# EAGLE design BT AQ DOL R3 (EAGLE 9.6.2)
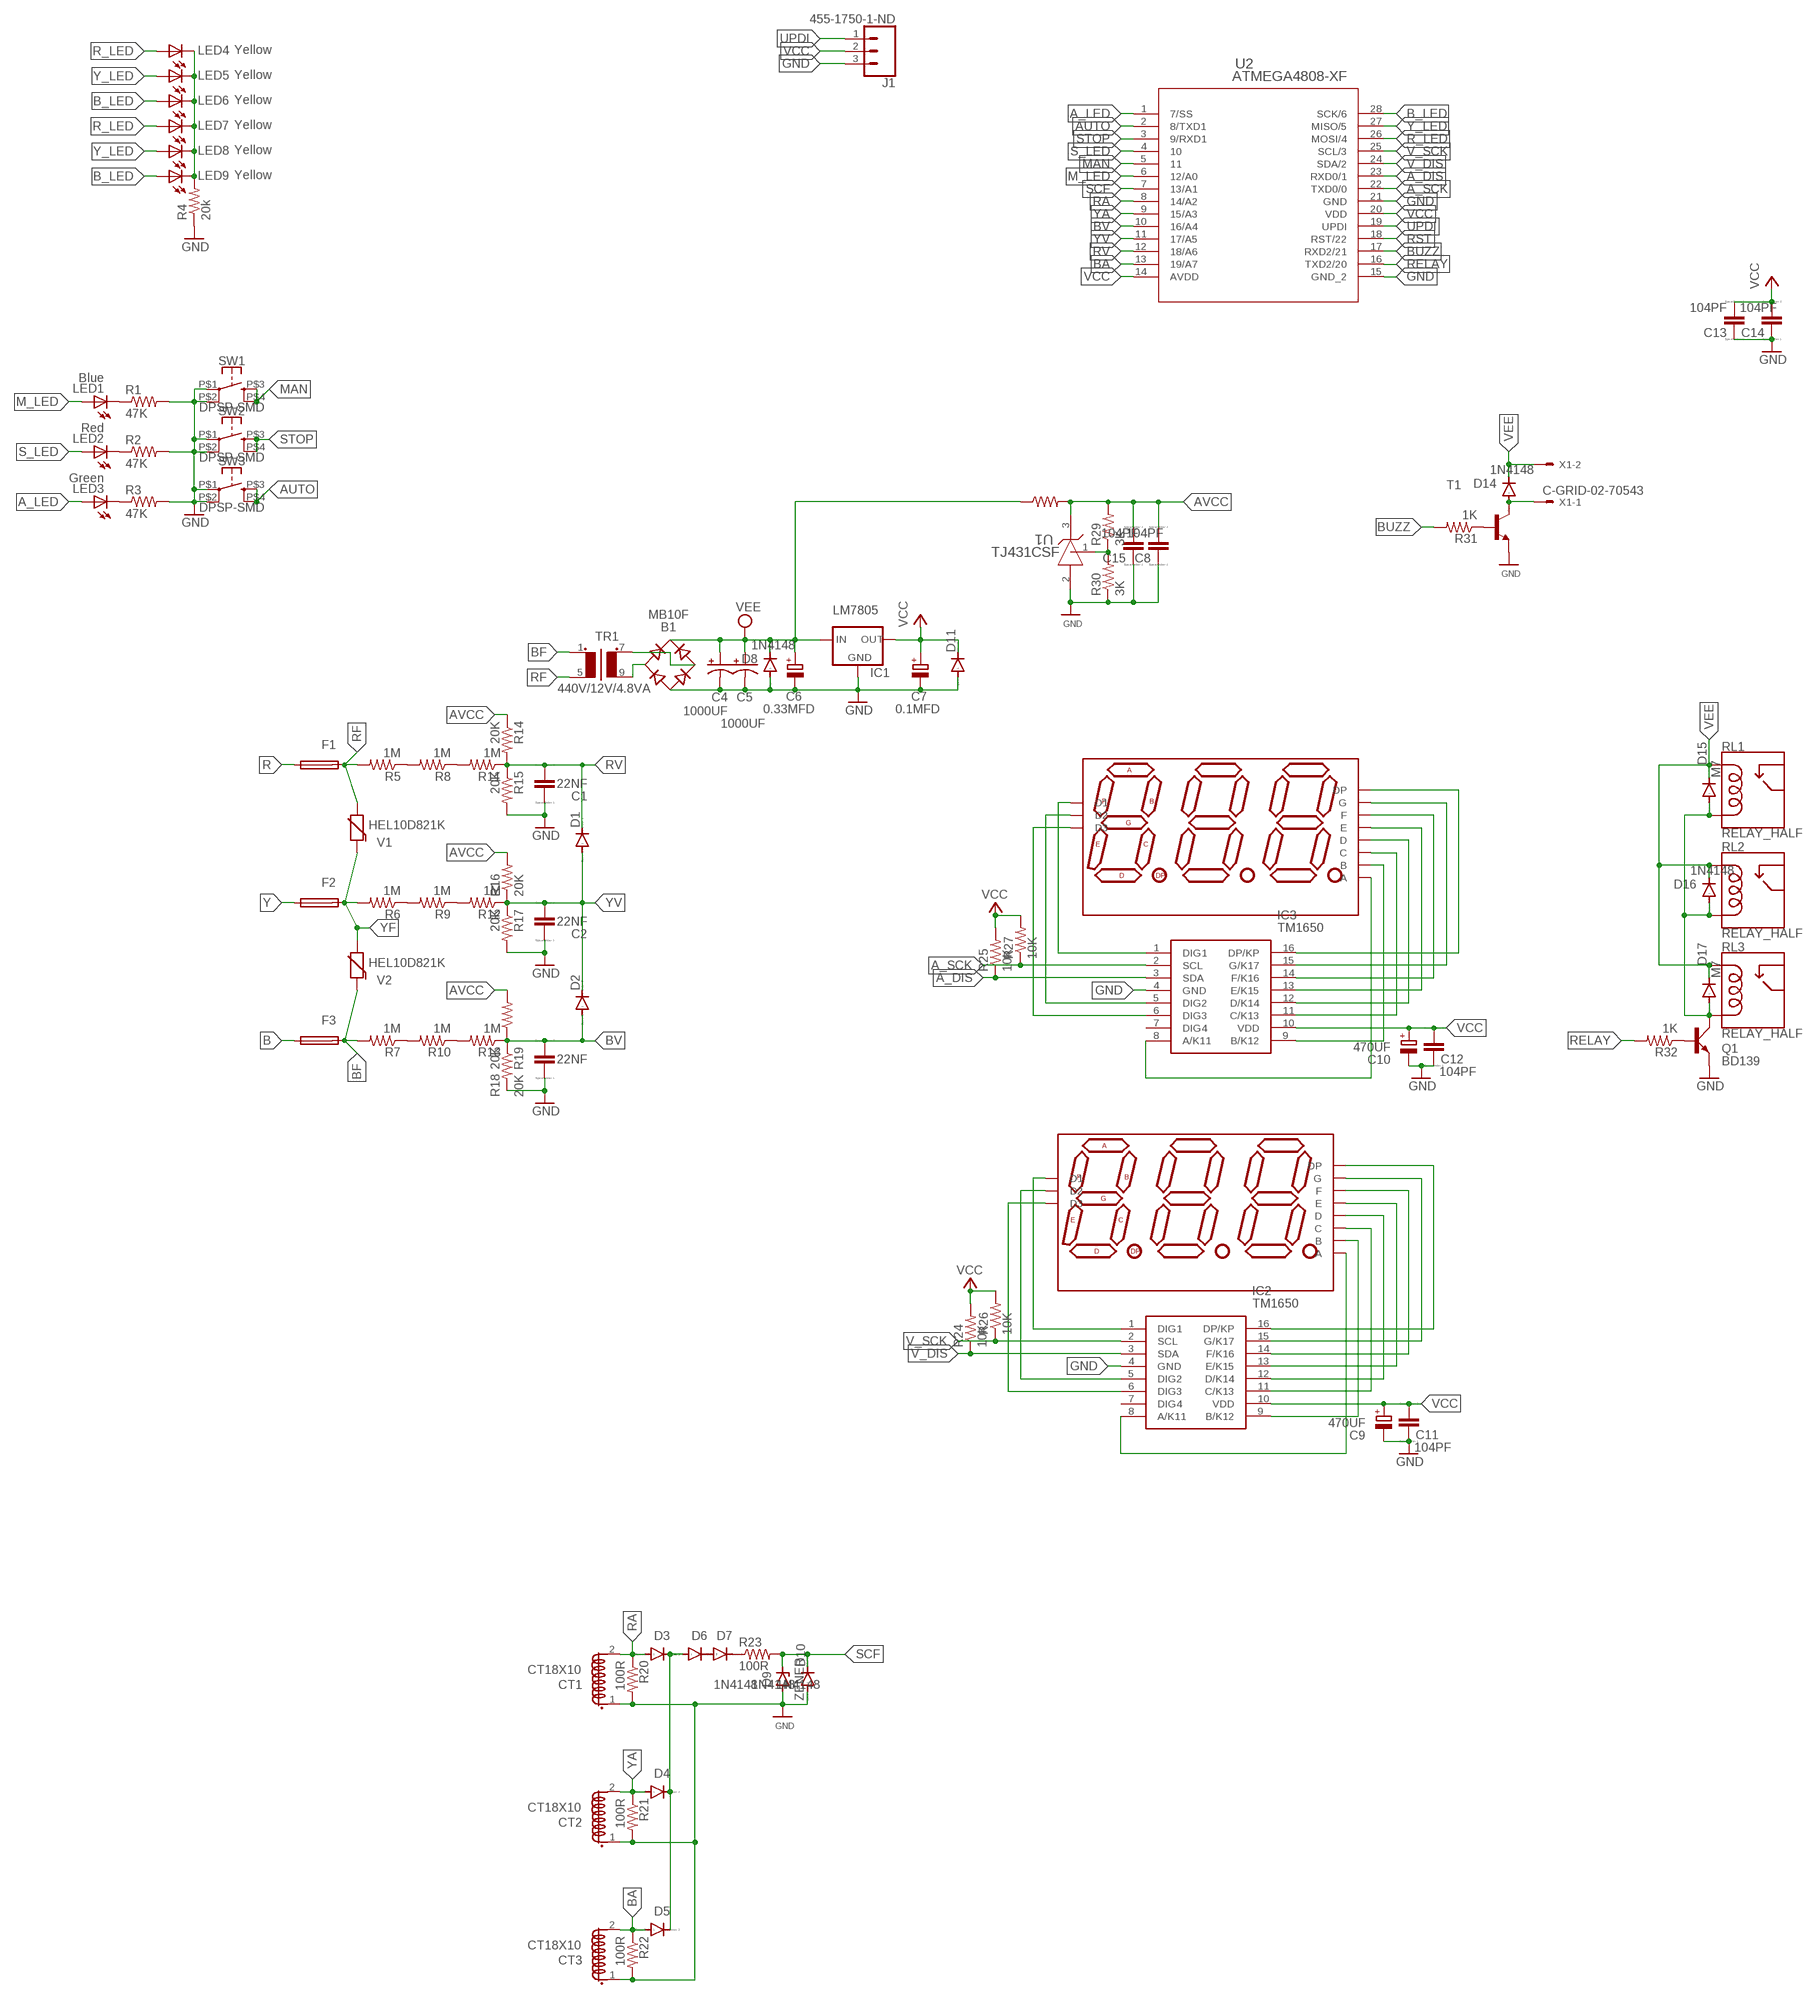
[diagram p0: schematic, sheet 1]

## Parts
B1  MB10F  MB8S  [SOIC-4]
C1  22NF  CC1206  [C1206]
C2  22NF  CC1206  [C1206]
C3  22NF  CC1206  [C1206]
C4  1000UF  CPOL-USE3.5-10  [E3,5-10]
C5  1000UF  CPOL-USE3.5-10  [E3,5-10]
C6  0.33MFD  CPOL-EUE2.5-5  [E2,5-5]
C7  0.1MFD  CPOL-EUE2.5-5  [E2,5-5]
C8  104PF  CC1206  [C1206]
C9  470UF  CPOL-EUE3.5-8  [E3,5-8]
C10  470UF  CPOL-EUE3.5-8  [E3,5-8]
C11  104PF  CC1206  [C1206]
C12  104PF  CC1206  [C1206]
C13  104PF  CC1206  [C1206]
C14  104PF  CC1206  [C1206]
C15  104PF  CC1206  [C1206]
CT1  CT18X10  [ZMCT103C]
CT2  CT18X10  [ZMCT103C]
CT3  CT18X10  [ZMCT103C]
D1  DIODE-DO214AA  [DO214AA]
D2  DIODE-DO214AA  [DO214AA]
D3  1N4148  DIODE-MINIMELF  [MINIMELF]
D4  1N4148  DIODE-MINIMELF  [MINIMELF]
D5  1N4148  DIODE-MINIMELF  [MINIMELF]
D6  1N4148  DIODE-MINIMELF  [MINIMELF]
D7  1N4148  DIODE-MINIMELF  [MINIMELF]
D8  1N4148  DIODE-MINIMELF  [MINIMELF]
D9  ZENER  ZENER__DO-213AA(SOD-80)  [DIOMELF3516]
D10  DIODE-DO214AA  [DO214AA]
D11  DIODE-DO214AA  [DO214AA]
D12  SUNR036CC3D  7SEGMENT-3DIGITDIP  [7S3D036_DIP]
D13  SUNR036CC3D  7SEGMENT-3DIGITDIP  [7S3D036_DIP]
D14  1N4148  DIODE-MINIMELF  [MINIMELF]
D15  M7  DIODE-DO-214AC  [DO-214AC]
D16  1N4148  DIODE-MINIMELF  [MINIMELF]
D17  M7  DIODE-DO-214AC  [DO-214AC]
F1  TRF600-150  PPTCPTH  [TRF600-150]
F2  TRF600-150  PPTCPTH  [TRF600-150]
F3  TRF600-150  PPTCPTH  [TRF600-150]
IC1  LM7805  78XXS  [78XXS]
IC2  TM1650  [SOIC127P604X185-16N]
IC3  TM1650  [SOIC127P604X185-16N]
J1  455-1750-1-ND  CONN_03  [1X03]
LED1  Blue  LED3MM  [LED3MM]
LED2  Red  LED3MM  [LED3MM]
LED3  Green  LED3MM  [LED3MM]
LED4  Yellow  LED3MM  [LED3MM]
LED5  Yellow  LED3MM  [LED3MM]
LED6  Yellow  LED3MM  [LED3MM]
LED7  Yellow  LED3MM  [LED3MM]
LED8  Yellow  LED3MM  [LED3MM]
LED9  Yellow  LED3MM  [LED3MM]
Q1  BD139  [TO126AV]
R1  47K  R-US_M1206  [M1206]
R2  47K  R-US_M1206  [M1206]
R3  47K  R-US_M1206  [M1206]
R4  20k  R-US_M1206  [M1206]
R5  1M  R-US_M1206  [M1206]
R6  1M  R-US_M1206  [M1206]
R7  1M  R-US_M1206  [M1206]
R8  1M  R-US_M1206  [M1206]
R9  1M  R-US_M1206  [M1206]
R10  1M  R-US_M1206  [M1206]
R11  1M  R-US_M1206  [M1206]
R12  1M  R-US_M1206  [M1206]
R13  1M  R-US_M1206  [M1206]
R14  20K  R-US_M1206  [M1206]
R15  20K  R-US_M1206  [M1206]
R16  20K  R-US_M1206  [M1206]
R17  20K  R-US_M1206  [M1206]
R18  20K  R-US_M1206  [M1206]
R19  20K  R-US_M1206  [M1206]
R20  100R  R-US_M1206  [M1206]
R21  100R  R-US_M1206  [M1206]
R22  100R  R-US_M1206  [M1206]
R23  100R  R-US_M1206  [M1206]
R24  10K  R-US_M1206  [M1206]
R25  10K  R-US_M1206  [M1206]
R26  10K  R-US_M1206  [M1206]
R27  10K  R-US_M1206  [M1206]
R28  10K  R-US_M1206  [M1206]
R29  3K  R-US_M1206  [M1206]
R30  3K  R-US_M1206  [M1206]
R31  1K  R-US_M1206  [M1206]
R32  1K  R-US_M1206  [M1206]
RL1  RELAY_HALF  [DT90_HALF]
RL2  RELAY_HALF  [DT90_HALF]
RL3  RELAY_HALF  [DT90_HALF]
SW1  DPSP-SMD  [B3F-40XX-ROUND-SMD]
SW2  DPSP-SMD  [B3F-40XX-ROUND-SMD]
SW3  DPSP-SMD  [B3F-40XX-ROUND-SMD]
T1  MMUN2213LT1-NPN-SC59-BEC  [SC59-BEC]
TR1  440V/12V/4.8VA  TRANSFORMER6VA  [440V12V6VA]
U1  TJ431CSF  TJ431CSFDBZ0003A_L  [SOT-23]
U2  ATMEGA4808-XF  [SSOP28_SS_MCH]
V1  HEL10D821K  VARISTOR  [10MM]
V2  HEL10D821K  VARISTOR  [10MM]
X1  C-GRID-02-70543  [70543-02]

## Nets
A_DIS: IC3.3(SDA) R25.1 U2.23(RXD0/1)
A_LED: LED3.A U2.1(7/SS)
A_SCK: IC3.2(SCL) R27.1 U2.22(TXD0/0)
AUTO: SW3.P$3 SW3.P$4 U2.2(8/TXD1)
AVCC: C8.2 C15.2 R14.1 R16.2 R18.2 R28.2 R29.2 U1.3(CATHODE)
B: F3.1
B_LED: LED6.A LED9.A U2.28(SCK/6)
BA: CT3.2(S1.2) D5.A R22.1 U2.13(19/A7)
BF: F3.2 R7.2 TR1.1 V2.1
BUZZ: R31.2 U2.17(RXD2/21)
BV: C3.2 D2.A R13.1 R18.1 R19.1 U2.10(16/A4)
GND: B1.- C1.1 C2.1 C3.1 C4.- C5.- C6.- C7.- C8.1 C9.- C10.- C11.1 C12.1 C13.1 C14.1 C15.1 CT1.1(S1.1) CT2.1(S1.1) CT3.1(S1.1) D8.A D9.2(A) D10.A D11.A IC1.GND IC2.4(GND) IC3.4(GND) J1.3 Q1.E R1.2 R2.2 R3.2 R4.1 R15.2 R17.2 R19.2 R20.2 R21.2 R22.2 R30.1 SW1.P$1 SW1.P$2 SW2.P$1 SW2.P$2 SW3.P$1 SW3.P$2 T1.E U1.2(ANODE) U2.15(GND_2) U2.21(GND)
M_LED: LED1.A U2.6(12/A0)
MAN: SW1.P$3 SW1.P$4 U2.5
N$1: B1.~2(AC2) TR1.7(S1)
N$2: B1.~1(AC1) TR1.9(S2)
N$3: D14.A T1.C X1.1
N$4: R31.1 T1.B
N$5: LED3.K(C) R3.1
N$6: LED2.K(C) R2.1
N$8: LED1.K(C) R1.1
N$9: R29.1 R30.2 U1.1(REF)
N$10: LED4.K(C) LED5.K(C) LED6.K(C) LED7.K(C) LED8.K(C) LED9.K(C) R4.2
N$11: D7.C R23.1
N$12: D6.C D7.A
N$13: R5.1 R8.2
N$14: R8.1 R11.2
N$15: R6.1 R9.2
N$18: R7.1 R10.2
N$19: R9.1 R12.2
N$22: Q1.B R32.1
N$23: R10.1 R13.2
N$28: D13.11(A) IC3.8(A/K11)
N$29: D13.7(B) IC3.9(B/K12)
N$30: D13.4(C) IC3.11(C/K13)
N$31: D13.2(D) IC3.12(D/K14)
N$32: D13.1(E) IC3.13(E/K15)
N$33: D13.10(F) IC3.14(F/K16)
N$34: D13.5(G) IC3.15(G/K17)
N$35: D13.3(DP) IC3.16(DP/KP)
N$36: D13.12(D1) IC3.1(DIG1)
N$37: D13.9(D2) IC3.5(DIG2)
N$38: D13.8(D3) IC3.6(DIG3)
N$39: D12.11(A) IC2.8(A/K11)
N$40: D12.7(B) IC2.9(B/K12)
N$41: D12.4(C) IC2.11(C/K13)
N$42: D3.C D4.C D5.C D6.A
N$44: D12.2(D) IC2.12(D/K14)
N$48: D12.1(E) IC2.13(E/K15)
N$49: D12.10(F) IC2.14(F/K16)
N$50: D12.5(G) IC2.15(G/K17)
N$51: D12.3(DP) IC2.16(DP/KP)
N$52: D12.12(D1) IC2.1(DIG1)
N$53: D12.9(D2) IC2.5(DIG2)
N$54: D12.8(D3) IC2.6(DIG3)
N$121: D15.A D16.A D17.A Q1.C RL1.2(COIL2) RL2.2(COIL2) RL3.2(COIL2)
R: F1.1
R_LED: LED4.A LED7.A U2.26(MOSI/4)
RA: CT1.2(S1.2) D3.A R20.1 U2.8(14/A2)
RELAY: R32.2 U2.16(TXD2/20)
RF: F1.2 R5.2 TR1.5(P2) V1.2
RST: U2.18(RST/22)
RV: C1.2 D1.C R11.1 R14.2 R15.1 U2.12(18/A6)
S_LED: LED2.A U2.4
SCF: D9.1(C) D10.C R23.2 U2.7(13/A1)
STOP: SW2.P$3 SW2.P$4 U2.3(9/RXD1)
UPDI: J1.1 U2.19(UPDI)
V_DIS: IC2.3(SDA) R24.1 U2.24(SDA/2)
V_SCK: IC2.2(SCL) R26.1 U2.25(SCL/3)
VCC: C7.+ C9.+ C10.+ C11.2 C12.2 C13.2 C14.2 D11.C IC1.OUT IC2.10(VDD) IC3.10(VDD) J1.2 R24.2 R25.2 R26.2 R27.2 U2.14(AVDD) U2.20(VDD)
VEE [VEE]: B1.+ C4.+ C5.+ C6.+ D8.C D14.C D15.C D16.C D17.C IC1.IN R28.1 RL1.1(COIL1) RL2.1(COIL1) RL3.1(COIL1) X1.2
Y: F2.1
Y_LED: LED5.A LED8.A U2.27(MISO/5)
YA: CT2.2(S1.2) D4.A R21.1 U2.9(15/A3)
YF: F2.2 R6.2 V1.1 V2.2
YV: C2.2 D1.A D2.C R12.1 R16.1 R17.1 U2.11(17/A5)
Unconnected: IC2.7(DIG4) IC3.7(DIG4)

## Library data of the parts
B1 = rectifier:MB*S: Bridge Rectifier Source: http://www.fairchildsemi.com/ds/MB/MB6S.pdf
C1-C3 C8 C11-C15 = eagle-ltspice:C: CAPACITOR, European symbol; SPICEMODEL: NONE; SPICEPREFIX: C
C4 C5 = rcl:CPOL-US: POLARIZED CAPACITOR, American symbol; SPICEPREFIX: C
C6 C7 C9 C10 = rcl:CPOL-EU: POLARIZED CAPACITOR, European symbol; SPICEPREFIX: C
CT1-CT3 = User Components:CT
D1-D8 D10 D11 D14-D17 = diode:DIODE-: DIODE
D9 = Tinkercad:ZENER: Zener Diode - Generic; CATEGORY: Diode; SUB-CATEGORY: Zener
D12 D13 = User Components:7SEGMENT-3DIGIT
F1-F3 = User Components:PPTC: FUSE Wickmann; OC_FARNELL: unknown; OC_NEWARK: unknown
IC1 = v-reg:78XXS: VOLTAGE REGULATOR
IC2 IC3 = User Components:TM1650: The TM1650 is a dedicated LED (LED display) drive control circuit with a keyboard scan interface. The MCU input and output control digital interface, data latch, LED driver, keyboard scan, brightness adjustment and other circuits are integrated inside. The TM1650's stable performance, reliable quality, and high immunity to interference make it suitable for long-term continuous operation in 24 hours Source: Datasheet <http://www.titanmec.com/index.php/en/product/download/id/540.html>; DESCRIPTION: The TM1650 is a dedicated LED (LED display) drive control circuit with a keyboard scan interface. The MCU input and output control digital interface, data latch, LED driver, keyboard scan, brightness adjustment and other circuits are integrated inside. The TM1650's stable performance, reliable quality, and high immunity to interference make it suitable for long-term continuous operation in 24 hours; HEIGHT: 1.85mm; MANUFACTURER_NAME: TITAN MICRO ELECTRONICS; MANUFACTURER_PART_NUMBER: tm1650
J1 = SparkFun-Connectors:CONN_03: Multi connection point. Often used as Generic Header-pin footprint for 0.1 inch spaced/style header connections On any of the 0.1 inch spaced packages, you can populate with these: Break Away Headers - Straight <https://www.sparkfun.com/products/116> (PRT-00116) Break Away Male Headers - Right Angle <https://www.sparkfun.com/products/553> (PRT-00553) Female Headers <https://www.sparkfun.com/products/115> (PRT-00115) Break Away Headers - Machine Pin <https://www.sparkfun.com/products/117> (PRT-00117) Break Away Female Headers - Swiss Machine Pin <https://www.sparkfun.com/products/743> (PRT-00743) Stackable Header - 3 Pin (Female, 0.1") <https://www.sparkfun.com/products/13875> (PRT-13875) For SCREWTERMINALS and SPRING TERMINALS visit here: Screw Terimnals on SparkFun.com <https://www.sparkfun.com/search/results?term=Screw+Terminals> (5mm/3.5mm/2.54mm spacing) This device is also useful as a general connection point to wire up your design to another part of your project. Our various solder wires solder well into these plated through hole pads. Hook-Up Wire - Assortment (Stranded, 22 AWG) <https://www.sparkfun.com/products/11375> (PRT-11375) Hook-Up Wire - Assortment (Solid Core, 22 AWG) <https://www.sparkfun.com/products/11367> (PRT-11367) View the entire wire category on our website here <https://www.sparkfun.com/categories/141> Special notes: Molex polarized connector foot print use with SKU : PRT-08232 with associated crimp pins and housings.; PROD_ID: XXX-00000
LED1-LED9 = adafruit:LED: LED OSRAM: - CHIPLED LG R971, LG N971, LY N971, LG Q971, LY Q971, LO R971, LY R971 LH N974, LH R974 LS Q976, LO Q976, LY Q976 LO Q996 - Hyper CHIPLED LW Q18S LB Q993, LB Q99A, LB R99A - SideLED LS A670, LO A670, LY A670, LG A670, LP A670 LB A673, LV A673, LT A673, LW A673 LH A674 LY A675 LS A676, LA A676, LO A676, LY A676, LW A676 LS A679, LY A679, LG A679 - Hyper Micro SIDELED® LS Y876, LA Y876, LO Y876, LY Y876 LT Y87S - SmartLED LW L88C, LW L88S LB L89C, LB L89S, LG L890 LS L89K, LO L89K, LY L89K LS L896, LA L896, LO L896, LY L896 - TOPLED LS T670, LO T670, LY T670, LG T670, LP T670 LSG T670, LSP T670, LSY T670, LOP T670, LYG T670 LG T671, LOG T671, LSG T671 LB T673, LV T673, LT T673, LW T673 LH T674 LS T676, LA T676, LO T676, LY T676, LB T676, LH T676, LSB T676, LW T676 LB T67C, LV T67C, LT T67C, LS T67K, LO T67K, LY T67K, LW E67C LS E67B, LA E67B, LO E67B, LY E67B, LB E67C, LV E67C, LT E67C LW T67C LS T679, LY T679, LG T679 LS T770, LO T770, LY T770, LG T770, LP T770 LB T773, LV T773, LT T773, LW T773 LH T774 LS E675, LA E675, LY E675, LS T675 LS T776, LA T776, LO T776, LY T776, LB T776 LHGB T686 LT T68C, LB T68C - Hyper Mini TOPLED® LB M676 - Mini TOPLED Santana® LG M470 LS M47K, LO M47K, LY M47K Source: http://www.osram.convergy.de/
Q1 = transistor-power:BD139: NPN TRANSISTOR
R1-R19 R24-R27 R31 R32 = rcl:R-US_: RESISTOR, American symbol; SPICEPREFIX: R
R20-R23 R28-R30 = rcl:R-US_: RESISTOR, American symbol
RL1-RL3 = User Components:RELAY_HALF
SW1-SW3 = User Components:DPSP-SMD
T1 = transistor:*-NPN-: NPN Transistror BF959 corrected 2008.03.06
TR1 = User Components:TRANSFORMER
U1 = User Components:TJ431CSF; COPYRIGHT: Copyright (C) 2022 Ultra Librarian. All rights reserved.; MANUFACTURER_PART_NUMBER: TL431IDBZTG4; MFR_NAME: Texas Instruments; REFDES: RefDes; TYPE: TYPE
U2 = User Components:ATMEGA4808-XF; COPYRIGHT: Copyright (C) 2022 Ultra Librarian. All rights reserved.; MANUFACTURER_PART_NUMBER: ATMEGA4808-XF; MFR_NAME: Microchip
V1 V2 = User Components:VARISTOR
X1 = con-molex:C-GRID-02: CONNECTOR wire to board 2.54 mm (0.100") pitch header; MF: MOLEX; OC_FARNELL: unknown; OC_NEWARK: unknown

## Net classes
0 default: width 0.254 mm, drill 0.508 mm, clearance 0.381 mm
1 VEE: width 0.762 mm, drill 0.508 mm, clearance 0.508 mm

## Board
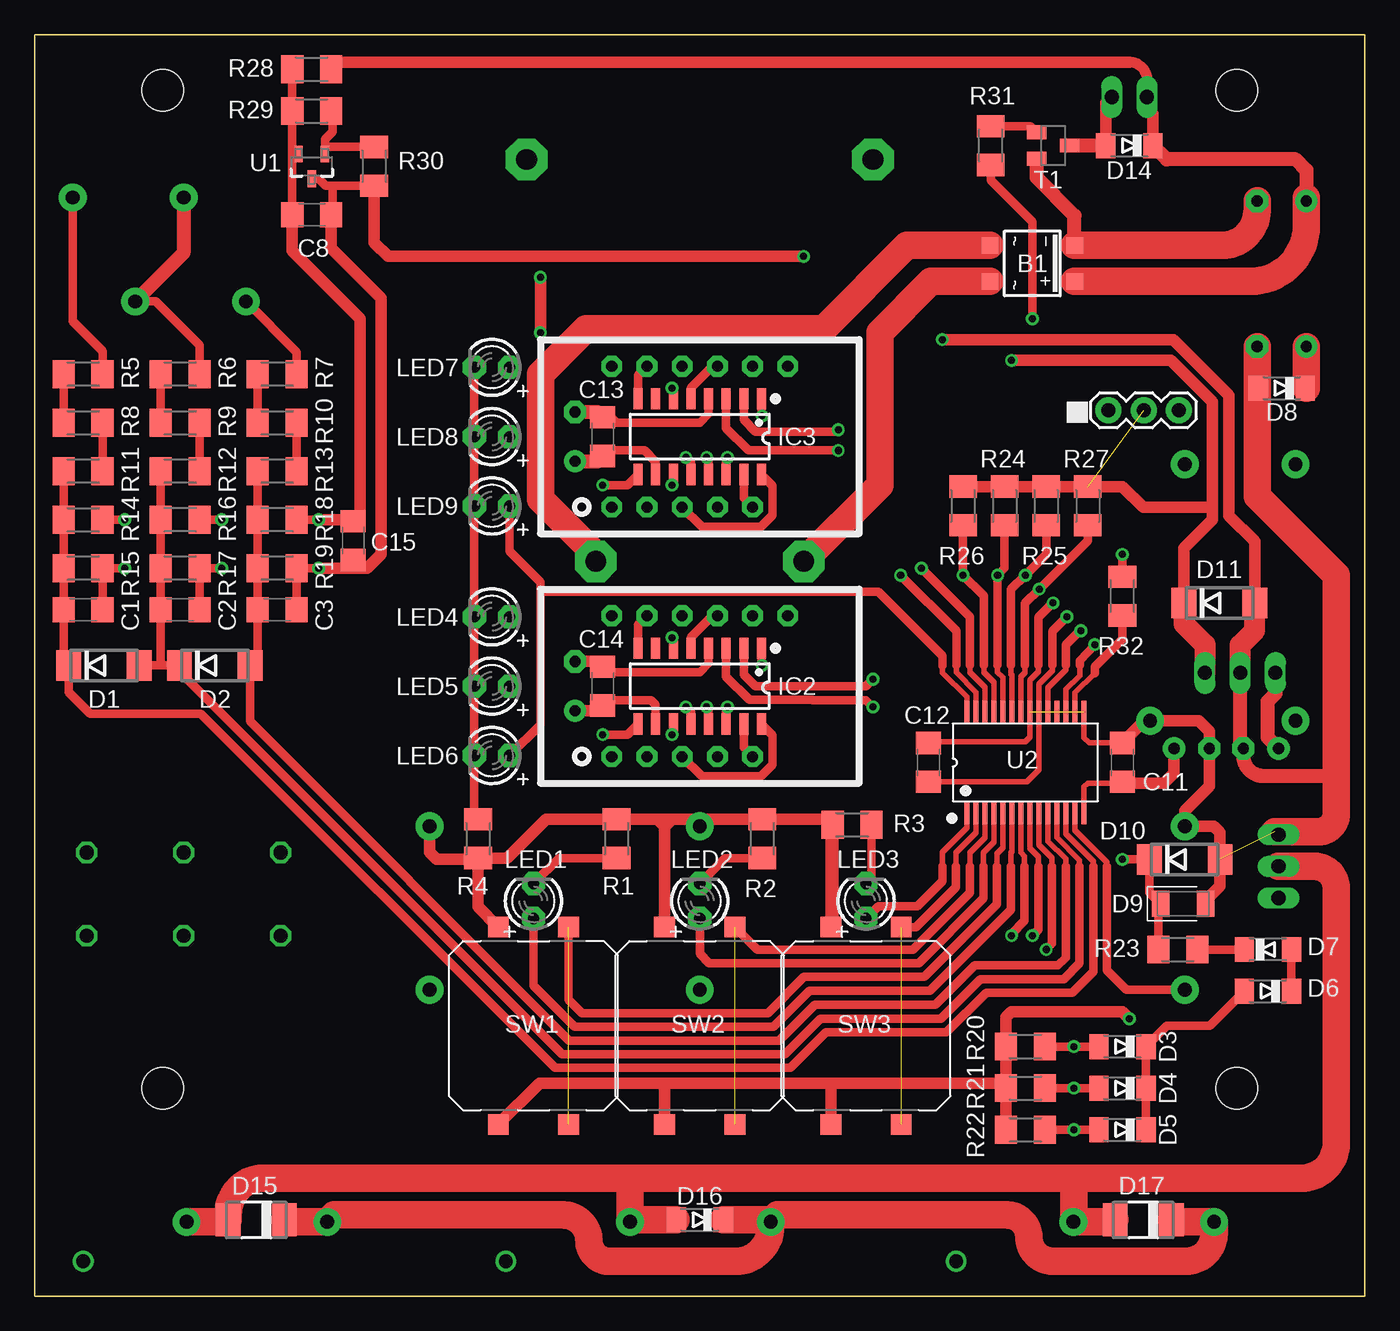
[diagram p1: board, top side]
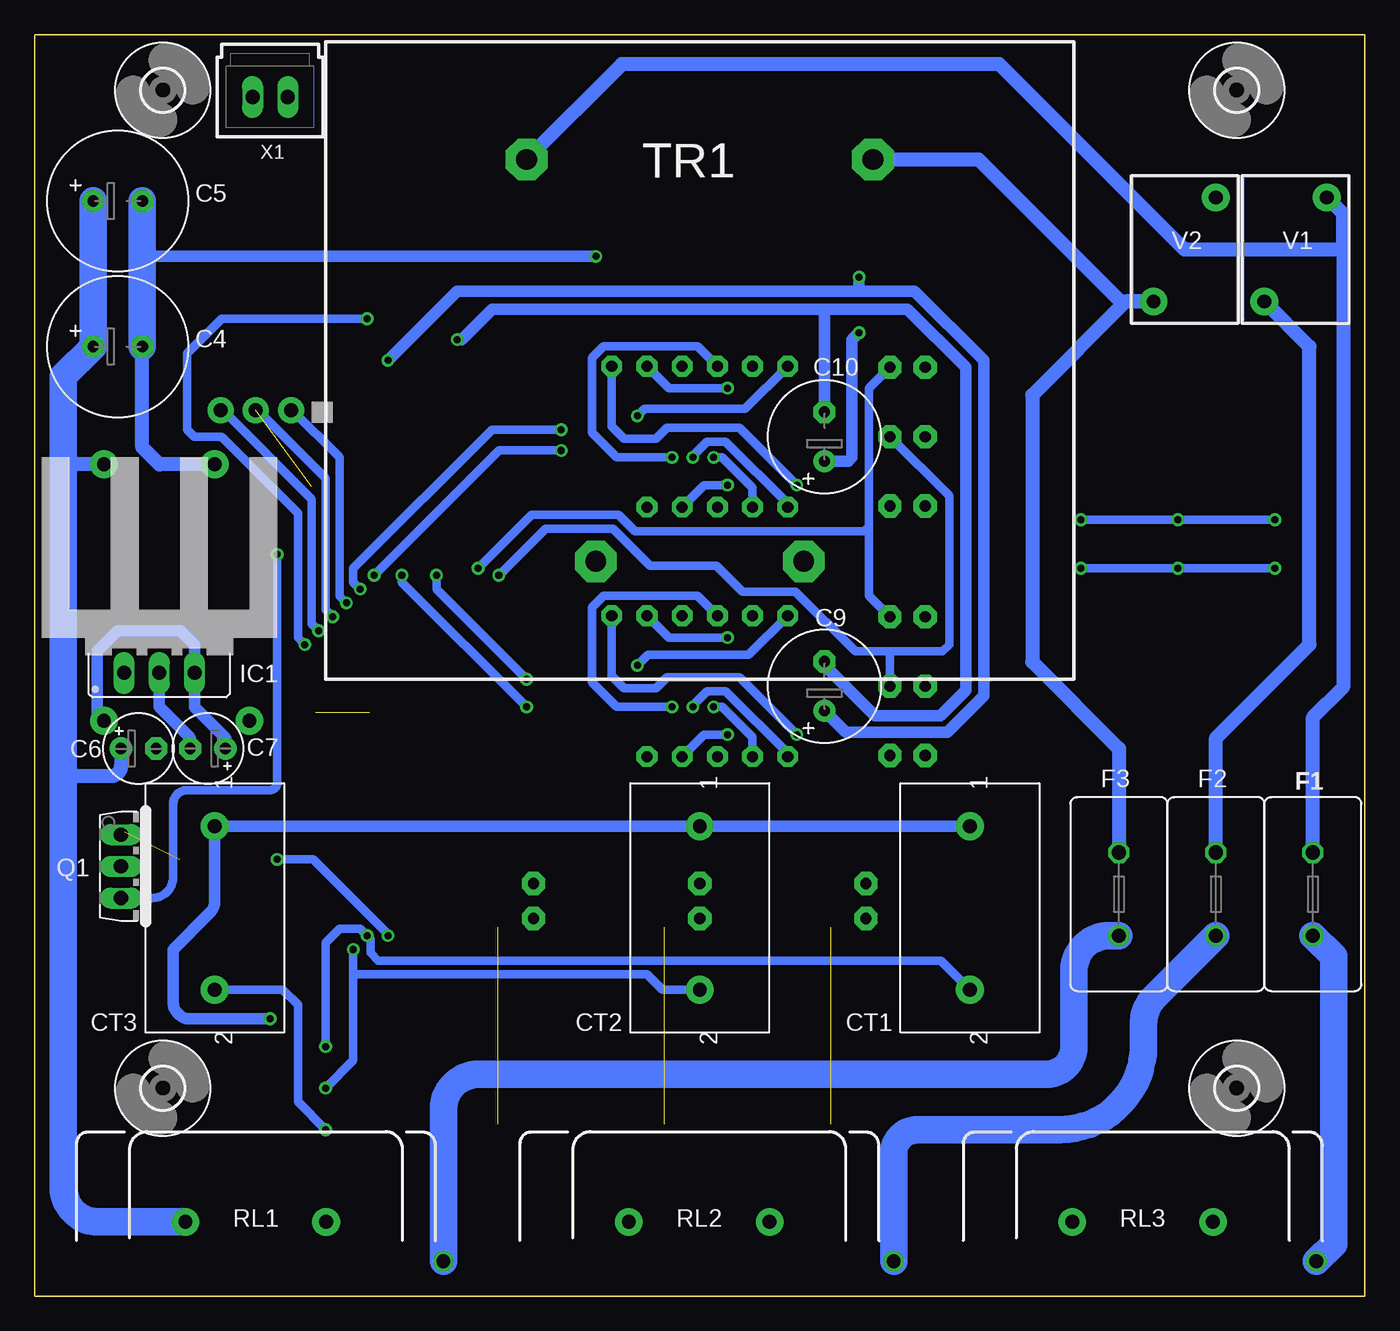
[diagram p2: board, bottom side, seen from below]

Size 96 x 91 mm. Coordinates in mm from the lower left corner, seen from the top.
Outline: 96,0 96,91 0,91 0,0 96,0
Copper layers (1*16): Top 0.035mm / dielectric 1.5mm / Bottom 0.035mm
Design rules "default *": minimum track width 6mil, minimum drill 0.35mm, track to track 6mil, track to pad 6mil, pad to pad 6mil, via to via 6mil, smd to smd 6mil, copper to edge 40mil, drill to drill 6mil, minimum pad ring 10mil, minimum via ring 8mil, stop-mask expansion 4mil, vias tented up to drill 20mil, thermal gap 10mil

### Footprints (pad centres in the part's own frame; a part is rotated, then mirrored left to right if it is on the bottom)
SOIC-4 = smd 1.2 x 1.2: + 1.3,3.05; - -1.3,3.05; ~1 -1.3,-3.05; ~2 1.3,-3.05
C1206 = smd 1.6 x 1.8: 1 -1.4,0; 2 1.4,0
E3,5-10 = drill 0.813 pad 1.6: + -1.778,0 | drill 0.813 pad 1.6 octagon: - 1.778,0
E2,5-5 = drill 0.813 pad 1.6: + -1.27,0 | drill 0.813 pad 1.6 octagon: - 1.27,0
E3,5-8 = drill 0.813 pad 1.6: + -1.778,0 | drill 0.813 pad 1.6 octagon: - 1.778,0
ZMCT103C = drill 1 pad 2: 1 -5.9,0; 2 5.9,0
DO214AA = smd 1.8 x 2.2: A 2.55,0; C -2.55,0
MINIMELF = smd 1.4 x 1.8: A 1.7,0; C -1.7,0
DIOMELF3516 = smd 1.275 x 1.85: 1 -1.62,0; 2 1.62,0
7S3D036_DIP = drill 0.8 pad 1.5 octagon: 1 -6.35,-5.08; 2 -3.81,-5.08; 3 -1.27,-5.08; 4 1.27,-5.08; 5 3.81,-5.08; 7 6.35,5.08; 8 3.81,5.08; 9 1.27,5.08; 10 -1.27,5.08; 11 -3.81,5.08; 12 -6.35,5.08
DO-214AC = smd 1.8 x 2.4: A 2.025,0; C -2.025,0
TRF600-150 = drill 1.016 octagon: 1 -3,0; 2 3,0
78XXS = drill 1.016 long: GND 0,-2.54; IN -2.54,-2.54; OUT 2.54,-2.54
SOIC127P604X185-16N = smd 1.53 x 0.65: 1 -2.735,4.445; 2 -2.735,3.175; 3 -2.735,1.905; 4 -2.735,0.635; 5 -2.735,-0.635; 6 -2.735,-1.905; 7 -2.735,-3.175; 8 -2.735,-4.445; 9 2.735,-4.445; 10 2.735,-3.175; 11 2.735,-1.905; 12 2.735,-0.635; 13 2.735,0.635; 14 2.735,1.905; 15 2.735,3.175; 16 2.735,4.445
1X03 = drill 1.016 pad 1.88: 1 0,0; 2 2.54,0; 3 5.08,0
LED3MM = drill 0.813 pad 1.676 octagon: A -1.27,0; K 1.27,0
TO126AV = drill 1.016 long: B 2.286,-1.27; C 0,-1.27; E -2.286,-1.27
M1206 = smd 1.6 x 2: 1 -1.4,0; 2 1.4,0
DT90_HALF = drill 1 pad 2: 1 -5.12,-0.15; 2 5.04,-0.15
B3F-40XX-ROUND-SMD = smd 1.5 x 1.5: P$1 -7.12,2.54; P$2 7.12,2.54; P$3 -7.12,-2.54; P$4 7.12,-2.54
SC59-BEC = smd 1 x 1.4: B -0.95,-1.2; C 0,1.2; E 0.95,-1.2
440V12V6VA = drill 1.5 pad 3 octagon: 1 -14.5,12.5; 5 -14.5,-12.5; 7 14.5,-7.5; 9 14.5,7.5
SOT-23 = smd 0.6 x 1.2: 1 -0.95,-0.9; 2 0,0.9; 3 0.95,-0.9
SSOP28_SS_MCH = smd 1.651 x 0.381: 1 -3.632,4.225; 2 -3.632,3.575; 3 -3.632,2.925; 4 -3.632,2.275; 5 -3.632,1.625; 6 -3.632,0.975; 7 -3.632,0.325; 8 -3.632,-0.325; 9 -3.632,-0.975; 10 -3.632,-1.625; 11 -3.632,-2.275; 12 -3.632,-2.925; 13 -3.632,-3.575; 14 -3.632,-4.225; 15 3.632,-4.225; 16 3.632,-3.575; 17 3.632,-2.925; 18 3.632,-2.275; 19 3.632,-1.625; 20 3.632,-0.975; 21 3.632,-0.325; 22 3.632,0.325; 23 3.632,0.975; 24 3.632,1.625; 25 3.632,2.275; 26 3.632,2.925; 27 3.632,3.575; 28 3.632,4.225
3,0 = hole 3: 0,0
10MM = drill 1 pad 2: 1 -3.75,2.25; 2 3.75,-2.25
70543-02 = drill 1.016 long: 1 -1.27,0; 2 1.27,0

### Placement (x,y rotation side)
B1  72,74.5 270 top
C1  3.5,49.5 180 top
C2  10.5,49.5 180 top
C3  17.5,49.5 180 top
C4  90,68.5 0 bottom
C5  90,79 0 bottom
C6  88.5,39.5 0 bottom
C7  83.5,39.5 180 bottom
C8  20,78 180 top
C9  39,44 90 bottom
C10  39,62 90 bottom
C11  78.5,38.5 270 top
C12  64.5,38.5 270 top
C13  41,62 270 top
C14  41,44 270 top
C15  23,54.5 90 top
CT1  28.5,28 270 bottom
CT2  48,28 270 bottom
CT3  83,28 270 bottom
D1  5,45.5 0 top
D2  13,45.5 0 top
D3  78.5,18 180 top
D4  78.5,15 180 top
D5  78.5,12 180 top
D6  89,22 180 top
D7  89,25 0 top
D8  90,65.5 180 top
D9  82.88,28.3 0 top
D10  83,31.5 0 top
D11  85.5,50 0 top
D12  48,44 0 top
D13  48,62 0 top
D14  79,83 180 top
D15  16,5.5 180 top
D16  48,5.5 180 top
D17  80,5.5 180 top
F1  3.75,29 90 bottom
F2  10.75,29 90 bottom
F3  17.75,29 90 bottom
IC1  87,47.5 0 bottom
IC2  48,44 270 top
IC3  48,62 270 top
J1  82.58,63.9 180 top
LED1  36,28.5 90 top
LED2  48,28.5 90 top
LED3  60,28.5 90 top
LED4  33,49 180 top
LED5  33,44 180 top
LED6  33,39 180 top
LED7  33,67 180 top
LED8  33,62 180 top
LED9  33,57 180 top
Q1  88.5,31 270 bottom
R1  42,33 90 top
R2  52.5,33 90 top
R3  59,34 180 top
R4  32,33 90 top
R5  3.5,66.5 0 top
R6  10.5,66.5 0 top
R7  17.5,66.5 0 top
R8  3.5,63 180 top
R9  10.5,63 180 top
R10  17.5,63 180 top
R11  3.5,59.5 0 top
R12  10.5,59.5 0 top
R13  17.5,59.5 0 top
R14  3.5,56 180 top
R15  3.5,52.5 0 top
R16  10.5,56 0 top
R17  10.5,52.5 0 top
R18  17.5,56 0 top
R19  17.5,52.5 0 top
R20  71.5,18 180 top
R21  71.5,15 180 top
R22  71.5,12 180 top
R23  82.5,25 180 top
R24  70,57 90 top
R25  73,57 90 top
R26  67,57 90 top
R27  76,57 90 top
R28  20,88.5 180 top
R29  20,85.5 180 top
R30  24.5,81.5 90 top
R31  69,83 270 top
R32  78.5,50.5 270 top
RL1  80,5.5 0 bottom
RL2  48,5.5 0 bottom
RL3  16,5.5 0 bottom
SW1  36,19.5 90 top
SW2  48,19.5 90 top
SW3  60,19.5 90 top
T1  73.5,83 270 top
TR1  48,67.5 270 bottom
U1  20,81.5 180 top
U2  71.5,38.5 90 top
U$1  [3,0]  86.75,15 0 bottom
U$2  [3,0]  9.25,15 0 bottom
U$3  [3,0]  86.75,87 0 bottom
U$4  [TO220_17X13]  87,54 0 bottom
U$8  [3,0]  9.25,87 0 bottom
V1  5,75.5 90 bottom
V2  13,75.5 90 bottom
X1  79,86.5 180 bottom

### Tracks (layer width: path | path; a pad name or v marks a point on that pad's centre or on a via)
A_DIS  (via drill 0.51)
  Top 0.38: 70.47,45.5 70.47,44.86 70.53,44.8 U2.23
  Top 0.61: IC3.3 49.91,62.59 51.5,61 v58,61 | 70.47,45.5 70.47,50.97 v71.5,52 73,53.5 R25.1
  Bottom 0.61: v58,61 62.5,61 v71.5,52
A_LED
  Top 0.38: U2.1 67.28,33.77 65.5,32 65.5,31
  Top 0.61: LED3.A 60.88,28.11 63.7,28.11 65.5,29.91 65.5,31
A_SCK  (via drill 0.51)
  Top 0.38: U2.22 71.17,44.26 71.17,44.67 71.46,44.96 71.46,45.5
  Top 0.61: IC3.2 51.17,63.21 52.03,62.36 57.86,62.36 v58,62.5 | 71.46,45.5 71.46,49.96 v72.5,51 76,54.5 R27.1
  Bottom 0.61: v72.5,51 73,51.5 73,52.5 63,62.5 v58,62.5
AUTO  (1 unrouted)
  Top 0.38: U2.2 67.92,33.42 66.49,31.99 66.49,31
  Top 0.61: SW3.P$4 63.61,26.62 66.49,29.5 66.49,31
AVCC  (via drill 0.51)
  Top 0.61: v6.5,56 R14.1 | v13.5,56 R16.2 | v20.5,56 R18.2 | 18.6,82.5 R29.2 R28.2 | 18.6,82.5 C8.2 | U1.3 18.7,82.4 18.6,82.5
  Top 0.813: C8.2 18.6,75.4 23.5,70.5 23.5,56.4 C15.2 23.1,56 v20.5,56
  Bottom 0.61: v6.5,56 v13.5,56 v20.5,56
B  (via drill 1)
  Bottom 2: F3.1 18.46,26 arc-90 21,23.46 21,18 arc90 23,16 63.96,16 arc-90 66.5,13.46 v66.5,2.5
B_LED
  Top 0.38: U2.28 67.28,43.23 65.52,44.98 65.52,45.48
  Top 0.61: LED9.A 34.27,53.73 36.5,51.5 36.5,51 | LED6.A 36.5,41.23 36.5,51 | 65.52,45.48 65.52,46.18 60.88,50.81 36.69,50.81 36.5,51
BA  (via drill 0.51)
  Top 0.38: U2.13 75.08,33.6 77.39,31.29 77.39,31
  Top 0.61: CT3.2 78.79,22.1 77.39,23.5 77.39,31 | R22.1 v75,12 D5.A
  Bottom 0.61: v75,12 77,14 77,21 78.1,22.1 CT3.2
BF
  Top 0.61: V2.1 18.9,68.1 R7.2
  Bottom 1: F3.2 17.75,39.5 24,45.75 24,65 17.25,71.75 V2.1 17.64,71.75 27.89,82 TR1.1
BUZZ  (via drill 0.51)
  Top 0.38: U2.17 74.42,43.77 75.42,44.77 75.42,45.5
  Top 0.61: v76.5,47 75.42,45.84 75.42,45.5 | R31.2 69,80.5 72,77.5 v72,70.5
  Bottom 0.61: v76.5,47 76.99,47.49 76.99,56.49 82.5,62 84.5,62 85,62.5 85,68 82.5,70.5 v72,70.5
BV
  Top 0.38: U2.10 73.12,32.82 74.42,31.53 74.42,31
  Top 0.61: R13.1 R18.1 R19.1 C3.2 16.1,46.05 D2.A 15.55,41.45 38.57,18.43 53.73,18.43 56.3,21 64.99,21 67.85,23.86 73.86,23.86 74.42,24.41 74.42,31
GND  (via drill 0.51, 1 pad 2)  (2 unrouted)
  Top 0.38: 72.45,45.5 72.45,45.04 71.83,44.41 U2.21 71.83,40.33 71.5,40 64.6,40 C12.1 | U2.15 75.72,40.27 76.1,39.9 C11.1
  Top 0.508: Q1.E 92.43,33.29 92.65,33.5
  Top 0.61: IC3.4 48.63,63.63 48,63 42,63 41.6,63.4 C13.1 | IC2.4 48.63,45.63 48,45 41.4,45 C14.1 | v73.5,50 72.45,48.95 72.45,45.5 | 21.5,78.5 21.5,78 C8.1 21.5,78.1 21.5,80.1 | R30.1 21.5,80.1 | 21.5,80.1 21,80.1 20.5,80.6 U1.2 | C1.1 R15.2 v6.5,52.5 | C2.1 R17.2 v13.5,52.5 | C3.1 R19.2 v20.5,52.5
  Top 0.813: 78.9,39.5 C11.1 80.1,41.5 v80.5,41.5 84,41.5 84.77,40.73 C7.- 84.77,36.77 83,35 CT3.1 85.1,33.9 85.55,33.45 D10.A 85.55,29.55 84.5,28.5 D9.2 | 57.58,12.5 SW3.P$1 57.46,15.32 57.5,15.36 | R21.2 R22.2 70.1,15.5 | 70.1,15.5 R20.2 70.1,20.1 70.5,20.5 78.5,20.5 v79,20 | SW2.P$2 45.46,33.86 | 45.46,33.86 45.46,33.9 44.96,34.4 | 33.1,26.98 SW1.P$2 32,28.08 R4.1 | C6.- 87,39.5 | D11.A 88.05,54.45 86.19,56.31 86.19,64.99 82.19,69 v65.5,69 | C14.1 40.62,45.78 C9.- | 44.96,34.4 R1.2 36.9,34.4 34.1,31.6 R4.1 | 57.46,34.14 R3.2 57.6,26.76 SW3.P$2 57.46,34.14 | CT1.1 28.5,32 29,31.5 31.9,31.5 R4.1 | R30.1 24.5,76 25.5,75 v55.5,75 | C8.1 21.4,75.6 25,72 25,53.5 24,52.5 23,52.5 | 57.46,34.14 57.2,34.4 R2.2 48.5,34.4 CT2.1 47.5,34.4 46,34.4 | 46,34.4 44.96,34.4 | 45.46,33.86 46,34.4 | SW1.P$1 36.44,15.36 45.5,15.36 | 70.1,15.5 69.96,15.36 57.5,15.36 | 45.5,15.36 57.5,15.36 | SW2.P$1 45.46,15.32 45.5,15.36 | v20.5,52.5 23,52.5 | C15.1 23,52.5
  Top 1.016: B1.- 75.05,77.95 72.3,80.7 T1.E | C4.- 88.22,65.58 D8.A | 93.43,37.5 88.73,37.5 arc-90 87.23,39 C6.- | 87,39.5 IC1.GND | C10.- 40.62,63.78 C13.1
  Top 1.5: IC1.GND 87,46.95 88.05,48 D11.A
  Top 2: B1.- 85.68,75.8 arc90 88.22,78.34 C5.- | C4.- 88.22,57.71 93.93,52 93.93,34.79 arc-90 92.65,33.5 89.5,33.5
  Bottom 0.61: v73.5,50 74,50.5 74,60.5 77.4,63.9 J1.3 | v6.5,52.5 v13.5,52.5 v20.5,52.5
  Bottom 0.813: CT3.1 CT2.1 CT1.1 | 83.4,33.9 CT3.1 | IC1.GND 87,42.5 84.77,40.27 C7.- | v65.5,69 65.19,69 62.99,71.19 39,71.19 | 39,71.19 33.01,71.19 28.81,66.99 28.81,43.69 30.63,41.87 35.37,41.87 39,45.5 C9.- | 39,71.19 C10.- | CT3.1 83.26,33.64 | CT3.1 83,28.5 arc45 83.35,27.65 86,25 86,21.21 arc-90 84.79,20 v79,20 | v55.5,75 88.22,75
  Bottom 1.016: v83,60 87,60 88.22,61.22 C4.-
  Bottom 2: C5.- 88.22,75 C4.-
M_LED
  Top 0.38: U2.6 70.53,32.06 70.45,31.99 70.45,31
  Top 0.61: 70.45,31 70.45,27.86 64.62,22.03 55.93,22.03 53.33,19.42 38.98,19.42 36,22.4 LED1.A
MAN  (1 unrouted)
  Top 0.38: U2.5 69.88,32.33 69.46,31.91 69.46,31
  Top 0.61: 69.46,31 69.46,28.27 64.21,23.02 55.52,23.02 52.91,20.41 39.5,20.41 38.54,21.37 SW1.P$4
N$1
  Top 2: B1.~2 64.7,73.2 61,69.5 61,58.5 TR1.7
N$2
  Top 2: TR1.9 40,54 36.5,57.5 36.5,66.5 39.8,69.8 56.95,69.8 62.95,75.8 B1.~1
N$3
  Top 0.813: X1.1 77.3,86.07 D14.A
  Top 1.016: D14.A T1.C
N$4
  Top 0.61: R31.1 71.85,84.4 T1.B
N$5
  Top 0.61: LED3.K 60.4,30.17 R3.1
N$6
  Top 0.61: LED2.K 49.83,31.6 R2.1
N$8
  Top 0.61: LED1.K 37.83,31.6 R1.1
N$9
  Top 0.61: U1.1 20.95,83 | 20.95,83 20.95,83.45 21.5,84 21.5,85.4 R29.1 | R30.2 21.05,82.9 20.95,83
N$10
  Top 0.61: LED7.K LED8.K LED9.K LED4.K LED5.K LED6.K 31.73,34.67 R4.2
N$11
  Top 0.61: D7.C R23.1
N$12
  Top 0.61: D6.C D7.A
N$13
  Top 0.61: R5.1 R8.2
N$14
  Top 0.61: R11.2 R8.1
N$15
  Top 0.61: R9.2 R6.1
N$18
  Top 0.61: R7.1 R10.2
N$19
  Top 0.61: R9.1 R12.2
N$22  (via drill 0.51)
  Top 0.61: R32.1 v78.5,53.5
  Bottom 0.61: v78.5,53.5 78.5,37 arc90 79,36.5 85,36.5 arc-90 86,35.5 86,30.5 86,30.21 arc90 87.5,28.71 Q1.B
N$23
  Top 0.61: R13.2 R10.1
N$28
  Top 0.61: D13.11 43.55,66.44 IC3.8
N$29  (via drill 0.51)
  Top 0.61: IC3.9 42.79,58.5 v41,58.5
  Bottom 0.61: D13.7 54.35,62.73 53.47,61.86 51.14,61.86 50.37,62.63 45.13,62.63 v41,58.5
N$30  (via drill 0.51)
  Top 0.61: IC3.11 46.09,58.59 v46,58.5
  Bottom 0.61: v46,58.5 47.69,58.5 D13.4
N$31  (via drill 0.51)
  Top 0.61: IC3.12 47.37,60.02 47.36,60.03 47.36,60.14 v47,60.5
  Bottom 0.61: v47,60.5 46.38,60.5 44.19,58.31 D13.2
N$32  (via drill 0.51)
  Top 0.61: IC3.13 48.63,60.37 v48.5,60.5
  Bottom 0.61: D13.1 41.65,57.17 46.13,61.64 47.47,61.64 48.5,60.62 v48.5,60.5
N$33  (via drill 0.51)
  Top 0.61: IC3.14 49.91,60.41 v50,60.5
  Bottom 0.61: D13.10 48.17,68.52 54.95,68.52 55.79,67.67 55.79,62.27 54.02,60.5 v50,60.5
N$34
  Top 0.61: D13.5 51.17,57.55 IC3.15
N$35
  Top 0.61: IC3.16 53.25,58.46 53.25,56.33 52.41,55.48 48.17,55.48 D13.3
N$36  (via drill 0.51)
  Top 0.61: v52.5,63.5 52.45,63.55 IC3.1
  Bottom 0.61: v52.5,63.5 52,64 44.73,64 D13.12
N$37
  Top 0.61: D13.9 48.92,67.08 47.37,65.53 IC3.5
N$38  (via drill 0.51)
  Top 0.61: IC3.6 46.09,65.41 v46,65.5
  Bottom 0.61: v46,65.5 50.23,65.5 D13.8
N$39
  Top 0.61: IC2.8 43.55,48.45 D12.11
N$40  (via drill 0.51)
  Top 0.61: IC2.9 42.79,40.5 v41,40.5
  Bottom 0.61: D12.7 54.35,44.73 53.47,43.86 51.14,43.86 50.37,44.63 45.13,44.63 v41,40.5
N$41  (via drill 0.51)
  Top 0.61: IC2.11 46.09,40.59 v46,40.5
  Bottom 0.61: D12.4 47.69,40.5 v46,40.5
N$42
  Top 0.61: D5.C D4.C D3.C 81.7,19.5 84.8,19.5 D6.A
N$44  (via drill 0.51)
  Top 0.61: IC2.12 47.37,42.02 47.36,42.03 47.36,42.14 v47,42.5
  Bottom 0.61: v47,42.5 46.38,42.5 44.19,40.31 D12.2
N$48  (via drill 0.51)
  Top 0.61: IC2.13 48.63,42.37 v48.5,42.5
  Bottom 0.61: D12.1 41.65,39.17 46.13,43.64 47.47,43.64 48.5,42.62 v48.5,42.5
N$49  (via drill 0.51)
  Top 0.61: IC2.14 49.91,42.41 v50,42.5
  Bottom 0.61: D12.10 48.17,50.52 54.95,50.52 55.79,49.67 55.79,44.27 54.02,42.5 v50,42.5
N$50
  Top 0.61: IC2.15 51.17,39.55 D12.5
N$51
  Top 0.61: IC2.16 53.25,40.46 53.25,38.33 52.41,37.48 48.17,37.48 D12.3
N$52  (via drill 0.51)
  Top 0.61: IC2.1 52.45,45.55 v52.5,45.5
  Bottom 0.61: v52.5,45.5 51.75,46.25 44.48,46.25 D12.12
N$53
  Top 0.61: IC2.5 47.37,47.52 48.92,49.08 D12.9
N$54  (via drill 0.51)
  Top 0.61: IC2.6 46.09,47.41 v46,47.5
  Bottom 0.61: v46,47.5 50.23,47.5 D12.8
N$121
  Top 2: 42.5,8.5 18,8.5 16.61,8.5 16.52,8.5 arc90 13.97,5.96 D15.A 13.82,5.35 RL3.2 | 42.5,8.5 75,8.5 | 75,8.5 75,5.39 RL1.2 77.83,5.35 D17.A | 42.5,8.5 42.96,8.04 RL2.2 43.11,5.5 D16.A | Q1.C 92.37,31 arc-90 93.93,29.43 93.93,11.04 arc-90 91.39,8.5 75,8.5
R  (via drill 1)
  Bottom 2: F1.1 2.25,24.5 2.25,3.75 v3.5,2.5
R_LED  (via drill 0.51)
  Top 0.38: U2.26 68.58,43.92 67.5,45 67.5,45.5
  Top 0.61: v64,52.5 67.5,49 67.5,45.5
  Bottom 0.61: LED7.A 35.79,65.48 35.79,55.5 | LED4.A 35.79,50.52 35.79,55.5 | 35.79,55.5 36.11,55.19 52.69,55.19 53.75,56.25 53.86,56.36 60.14,56.36 v64,52.5
RA  (via drill 0.51)
  Top 0.38: U2.8 71.83,32.31 72.43,31.7 72.43,31
  Top 0.61: D3.A v75,18 R20.1 | v72,26 72.43,26.43 72.43,31
  Bottom 0.61: CT1.2 30.61,24.21 71,24.21 71.21,24.21 71.75,24.75 71.75,25.75 v72,26 72.5,26.5 74,26.5 75,25.5 v75,18
RELAY
  Top 0.38: U2.16 75.08,43.52 76.5,44.95
  Top 0.61: 76.5,44.95 76.5,45.4 78.5,47.4 R32.2
RF
  Top 0.61: V1.2 2.75,70.32 4.9,68.17 R5.2
  Bottom 1: F1.2 3.75,41.75 1.57,43.93 1.57,75.5 | 1.57,75.5 1.57,78.07 V1.2 | 1.57,75.5 13,75.5 26.38,88.88 53.62,88.88 TR1.5
RV
  Top 0.38: U2.12 74.42,33.35 76.4,31.38 76.4,31
  Top 0.61: 76.4,31 76.4,23.4 74.88,21.88 68.67,21.88 65.81,19.02 57.12,19.02 54.56,16.45 37.55,16.45 12,42 4,42 2.45,43.55 D1.C 2.1,45.85 C1.2 R15.1 R14.2 R11.1
S_LED
  Top 0.38: U2.4 69.22,32.73 68.47,31.97 68.47,31
  Top 0.61: LED2.A 48,24.69 48.68,24.01 63.8,24.01 68.47,28.68 68.47,31
SCF  (via drill 0.51)
  Top 0.38: U2.7 71.17,32 71.44,31.73 71.44,31
  Top 0.61: v78.5,31.5 D10.C 80.45,29.11 D9.1 81.1,28.14 R23.2 | 71.44,31 71.44,27.06 70.5,26.12 v70.5,26
  Bottom 0.61: v70.5,26 70.44,26.06 75.88,31.5 v78.5,31.5
STOP  (1 unrouted)
  Top 0.38: U2.3 68.58,33.08 67.48,31.98 67.48,31
  Top 0.61: SW2.P$4 52.16,25 63.39,25 67.48,29.09 67.48,31
UPDI  (via drill 0.51)
  Top 0.38: 74.43,45.5 74.43,45.19 73.12,43.88 U2.19
  Top 0.61: 74.43,45.5 74.43,47 75.43,48 v75.5,48
  Bottom 0.61: v75.5,48 76,48.5 76,57.5 82.4,63.9 J1.1
V_DIS  (via drill 0.51)
  Top 0.38: U2.24 69.88,44.62 69.48,45.02 69.48,45.5
  Top 0.61: IC2.3 49.91,44.69 51.59,43.01 56.13,43.01 56.13,43 60,43 v60.5,42.5 | 69.48,45.5 69.48,51.98 v69.5,52 70,52.5 R24.1
  Bottom 0.61: v69.5,52 69.5,51.5 v60.5,42.5
V_SCK  (via drill 0.51)
  Top 0.38: U2.25 69.22,44.27 68.49,45.01 68.49,45.5
  Top 0.61: IC2.2 51.17,44.83 52,44 60,44 v60.5,44.5 | R26.1 v67,52 68.49,50.51 68.49,45.5
  Bottom 0.61: v67,52 67,51 v60.5,44.5
VCC  (via drill 0.51, 1 pad 2)  (1 unrouted)
  Top 0.38: 73.44,45.5 73.44,45.11 72.47,44.15 U2.20 72.47,37.98 71.6,37.1 C12.2 | U2.14 75.72,36.73 76,37 78.5,37 78.6,37
  Top 0.61: IC3.10 44.83,60.17 44,61 41.4,61 C13.2 | IC2.10 44.83,42.67 44.5,43 41.4,43 C14.2 | v74.5,49 73.44,47.94 73.44,45.5
  Top 0.813: C11.2 78.6,37 | R24.2 R26.2 R25.2 R27.2 78.5,58.4 80,56.9 84.9,56.9 85,57 | 83.1,50.15 D11.C 82.95,53.95 85,56 85,57 | 84.5,44.92 IC1.OUT | 78.5,37 81.5,37 82.23,37.73 C7.+ | 85,57 85,64.5 82,67.5 v70.5,67.5 | v36.5,73.5 v36.5,69.5 | C14.2 40.62,42.22 C9.+
  Top 1.016: 40.9,60.5 C13.2 40.62,60.22 C10.+
  Top 1.5: D11.C 82.95,48.5 84.46,46.99 IC1.OUT
  Bottom 0.61: v74.5,49 75,49.5 75,59 79.9,63.9 J1.2
  Bottom 0.813: C7.+ 82.23,40.23 84.46,42.46 IC1.OUT 84.46,47 85.46,48 90,48 91.5,46.5 91.5,42 v91,41.5 | v70.5,67.5 65.5,72.5 36.5,72.5 | 36.5,72.5 32.5,72.5 27.5,67.5 27.5,43.31 30.13,40.68 37.46,40.68 C9.+ | C10.+ 37.28,60.22 37,60.5 37,69 v36.5,69.5 | v36.5,73.5 36.5,72.5
VEE  (via drill 1 pad 2)
  Top 0.762: 79,89.03 arc-90 80.27,87.76 X1.2
  Top 0.813: X1.2 80.27,85.73 80.7,85.3 D14.C | 79,89.03 21.93,89.03 R28.1
  Top 1.016: D14.C 81.7,82 91,82 91.78,81.22 91.78,79.22 C5.+ | 91.78,65.5 D8.C 91.78,65.58 C4.+ | IC1.IN 89.54,43.46 88.98,42.9 88.98,40.31 89.05,40.25 89.05,40.22 C6.+
  Top 2: 91.78,65.5 C4.+ | D15.C 18.18,5.35 RL3.1 21.62,5.85 38.15,5.85 arc-90 40,4 arc90 41.5,2.5 50.58,2.5 arc90 53.12,5.04 RL2.1 | D17.C 82.17,5.35 RL1.1 85.12,4.54 arc-90 83.08,2.5 73.5,2.5 arc-90 71.75,4.25 arc90 70.15,5.85 53.62,5.85 RL2.1 | D16.C 52.97,5.5 RL2.1 | B1.+ 87.74,73.2 arc90 91.78,77.24 91.78,79.22
  Bottom 1.016: v91,60 93.93,60 | C6.+ 89.77,38.23 arc90 90.5,37.5 93.93,37.5
  Bottom 2: C5.+ C4.+ 93.93,66.34 93.93,60 93.93,37.5 93.93,7.89 arc-90 91.39,5.35 RL1.1
Y  (via drill 1)
  Bottom 2: v34,2.5 34,10.29 arc45 33.5,11.5 arc45 32.29,12 22.04,12 arc-90 15.97,18.07 15.97,19.72 arc45 15.23,21.52 12.12,24.62 F2.1
Y_LED  (via drill 0.51)
  Top 0.38: U2.27 67.92,43.58 66.51,44.99 66.51,45.5
  Top 0.61: v62.5,52 66.51,47.99 66.51,45.5
  Bottom 0.61: LED8.A 30,57.73 30,47 30.5,46.5 34.5,46.5 | v62.5,52 59.13,55.37 54.27,55.37 51.6,52.7 46.79,52.7 44.91,50.81 41.08,50.81 36.77,46.5 34.5,46.5 | LED5.A 34.27,46.27 34.5,46.5
YA  (via drill 0.51)
  Top 0.38: U2.9 72.47,32.56 73.42,31.61 73.42,31
  Top 0.61: R21.1 v75,15 D4.A | v73,25 73.42,25.43 73.42,31
  Bottom 0.61: CT2.2 50.7,22.1 51.81,23.21 72.78,23.21 73,23 | v73,25 73,23 | 73,23 73,17 v75,15
YF
  Top 0.61: R6.2 11.9,68.6 8.75,71.75 V1.1
  Top 1: V2.2 10.75,75.25 V1.1
  Bottom 1: F2.2 10.75,40.25 4,47 4,68.5 V1.1
YV
  Top 0.38: U2.11 73.78,33.09 75.41,31.46 75.41,31
  Top 0.61: R12.1 R16.1 R17.1 C2.2 9.1,45.6 9,45.5 | 75.41,31 75.41,24 74.27,22.87 68.26,22.87 65.4,20.01 56.71,20.01 54.15,17.44 38.06,17.44 10.45,45.05 D2.C 10.22,45.73 10,45.5 9,45.5 | D1.A 9,45.5

### Text on the board
Reference: BT AQ DOL R3